# EAGLE schematic TP_DESIGN (EAGLE 5.11)
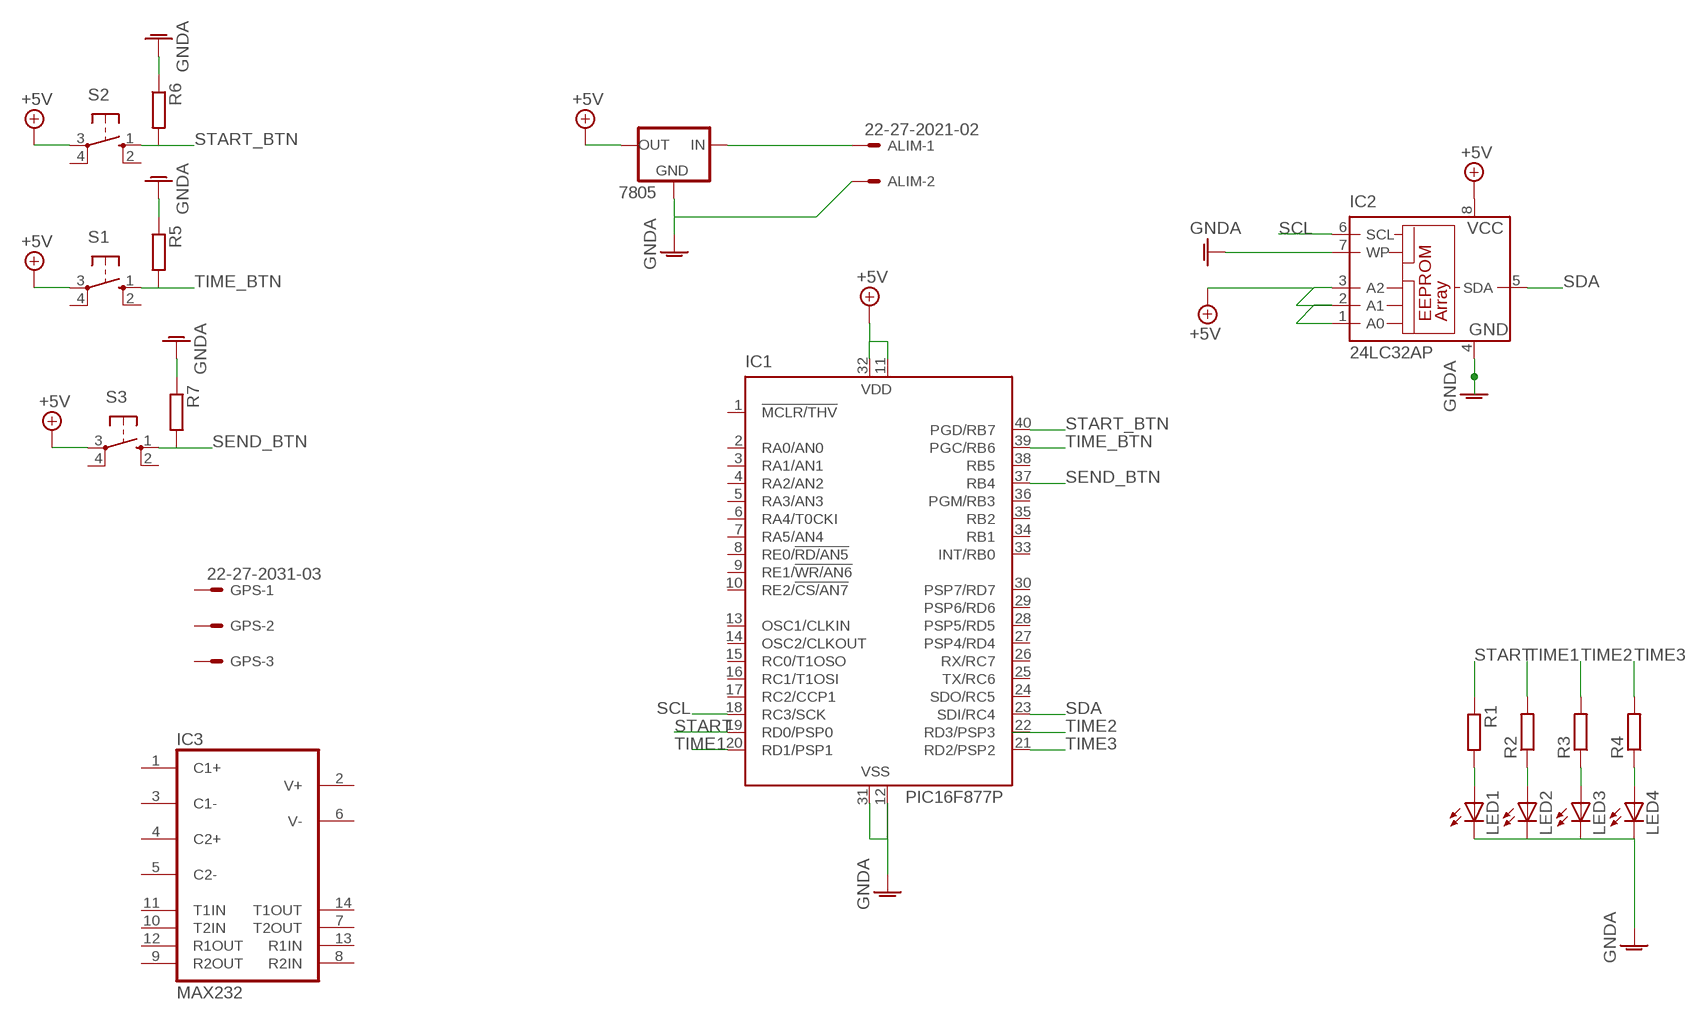
[diagram p0: schematic, sheet 1]

## Parts
7805  78XXL  [78XXL]
ALIM  22-27-2021-02  [6410-02]
GPS  22-27-2031-03  [6410-03]
IC1  PIC16F877P  [DIL40]
IC2  24LC32AP  [DIL8]
IC3  MAX232  [DIL16]
LED1  LED5MM  [LED5MM]
LED2  LED5MM  [LED5MM]
LED3  LED5MM  [LED5MM]
LED4  LED5MM  [LED5MM]
R1  R-EU_0207/10  [0207/10]
R2  R-EU_0207/10  [0207/10]
R3  R-EU_0207/10  [0207/10]
R4  R-EU_0207/10  [0207/10]
R5  R-EU_0207/10  [0207/10]
R6  R-EU_0207/10  [0207/10]
R7  R-EU_0207/10  [0207/10]
S1  10-XX  [B3F-10XX]
S2  10-XX  [B3F-10XX]
S3  10-XX  [B3F-10XX]

## Nets
+5V: 7805.OUT IC1.11(VDD) IC1.32(VDD) IC2.1(A0) IC2.2(A1) IC2.3(A2) IC2.8(VCC) S1.3(P) S2.3(P) S3.3(P)
GNDA: 7805.GND ALIM.2 IC1.12(VSS) IC1.31(VSS) IC2.4(GND) IC2.7(WP) LED1.K(C) LED2.K(C) LED3.K(C) LED4.K(C) R5.1 R6.1 R7.1
N$1: LED1.A R1.2
N$2: LED2.A R2.1
N$3: LED3.A R3.1
N$4: LED4.A R4.1
N$6: 7805.IN ALIM.1
SCL: IC1.18(RC3/SCK) IC2.6(SCL)
SDA: IC1.23(SDI/RC4) IC2.5(SDA)
SEND_BTN: IC1.37(RB4) R7.2 S3.1(S)
START: IC1.19(RD0/PSP0) R1.1
START_BTN: IC1.40(PGD/RB7) R6.2 S2.1(S)
TIME1: IC1.20(RD1/PSP1) R2.2
TIME2: R3.2
TIME3: IC1.21(RD2/PSP2) R4.2
TIME_BTN: IC1.39(PGC/RB6) R5.2 S1.1(S)
Unconnected: GPS.1 GPS.2 GPS.3 IC1.1(!MCLR/THV) IC1.2(RA0/AN0) IC1.3(RA1/AN1) IC1.4(RA2/AN2) IC1.5(RA3/AN3) IC1.6(RA4/T0CKI) IC1.7(RA5/AN4) IC1.8(RE0/!RD/AN5) IC1.9(RE1/!WR/AN6) IC1.10(RE2/!CS/AN7) IC1.13(OSC1/CLKIN) IC1.14(OSC2/CLKOUT) IC1.15(RC0/T1OSO) IC1.16(RC1/T1OSI) IC1.17(RC2/CCP1) IC1.22(RD3/PSP3) IC1.24(SDO/RC5) IC1.25(TX/RC6) IC1.26(RX/RC7) IC1.27(PSP4/RD4) IC1.28(PSP5/RD5) IC1.29(PSP6/RD6) IC1.30(PSP7/RD7) IC1.33(INT/RB0) IC1.34(RB1) IC1.35(RB2) IC1.36(PGM/RB3) IC1.38(RB5) IC3.1(C1+) IC3.2(V+) IC3.3(C1-) IC3.4(C2+) IC3.5(C2-) IC3.6(V-) IC3.7(T2OUT) IC3.8(R2IN) IC3.9(R2OUT) IC3.10(T2IN) IC3.11(T1IN) IC3.12(R1OUT) IC3.13(R1IN) IC3.14(T1OUT) S1.2(S1) S1.4(P1) S2.2(S1) S2.4(P1) S3.2(S1) S3.4(P1)

## Power pins joined to a net without a drawn wire
GNDA: IC3.15(GND)
VCC: IC3.16(VCC)

## Library data of the parts
7805 = v-reg:78XXL: VOLTAGE REGULATOR
ALIM = con-molex:22-?-02: CONNECTOR wire to board 2.54 mm (.1 inch) pitch header; OC_FARNELL: unknown; OC_NEWARK: unknown
GPS = con-molex:22-?-03: CONNECTOR wire to board 2.54 mm (.1 inch) pitch header; OC_FARNELL: unknown; OC_NEWARK: unknown
IC1 = microchip:PIC16F87*: MICROCONTROLLER; MF: MICROCHIP; MPN: PIC16F877-04/P; OC_FARNELL: 9761349; OC_NEWARK: 61K3463
IC2 = microchip:24*: Serial EEPROM I2C; MF: MICROCHIP; MPN: 24LC32A/P; OC_FARNELL: 1084246; OC_NEWARK: 75K1884
IC3 = maxim:MAX232: RS232 TRANSEIVER; MF: MAXIM; MPN: MAX232ACPE+; OC_FARNELL: 9723773; OC_NEWARK: 68K4544
LED1-LED4 = led:LED: LED OSRAM: - CHIPLED LG R971, LG N971, LY N971, LG Q971, LY Q971, LO R971, LY R971 LH N974, LH R974 LS Q976, LO Q976, LY Q976 LO Q996 - Hyper CHIPLED LW Q18S LB Q993, LB Q99A, LB R99A - SideLED LS A670, LO A670, LY A670, LG A670, LP A670 LB A673, LV A673, LT A673, LW A673 LH A674 LY A675 LS A676, LA A676, LO A676, LY A676, LW A676 LS A679, LY A679, LG A679 - Hyper Micro SIDELED® LS Y876, LA Y876, LO Y876, LY Y876 LT Y87S - SmartLED LW L88C, LW L88S LB L89C, LB L89S, LG L890 LS L89K, LO L89K, LY L89K LS L896, LA L896, LO L896, LY L896 - TOPLED LS T670, LO T670, LY T670, LG T670, LP T670 LSG T670, LSP T670, LSY T670, LOP T670, LYG T670 LG T671, LOG T671, LSG T671 LB T673, LV T673, LT T673, LW T673 LH T674 LS T676, LA T676, LO T676, LY T676, LB T676, LH T676, LSB T676, LW T676 LB T67C, LV T67C, LT T67C, LS T67K, LO T67K, LY T67K, LW E67C LS E67B, LA E67B, LO E67B, LY E67B, LB E67C, LV E67C, LT E67C LW T67C LS T679, LY T679, LG T679 LS T770, LO T770, LY T770, LG T770, LP T770 LB T773, LV T773, LT T773, LW T773 LH T774 LS E675, LA E675, LY E675, LS T675 LS T776, LA T776, LO T776, LY T776, LB T776 LHGB T686 LT T68C, LB T68C - Hyper Mini TOPLED® LB M676 - Mini TOPLED Santana® LG M470 LS M47K, LO M47K, LY M47K Source: http://www.osram.convergy.de LUXEON: - LUMILED® LXK2-PW12-R00, LXK2-PW12-S00, LXK2-PW14-U00, LXK2-PW14-V00 LXK2-PM12-R00, LXK2-PM12-S00, LXK2-PM14-U00 LXK2-PE12-Q00, LXK2-PE12-R00, LXK2-PE12-S00, LXK2-PE14-T00, LXK2-PE14-U00 LXK2-PB12-K00, LXK2-PB12-L00, LXK2-PB12-M00, LXK2-PB14-N00, LXK2-PB14-P00, LXK2-PB14-Q00 LXK2-PR12-L00, LXK2-PR12-M00, LXK2-PR14-Q00, LXK2-PR14-R00 LXK2-PD12-Q00, LXK2-PD12-R00, LXK2-PD12-S00 LXK2-PH12-R00, LXK2-PH12-S00 LXK2-PL12-P00, LXK2-PL12-Q00, LXK2-PL12-R00 Source: www.luxeon.com KINGBRIGHT: KA-3528ASYC Source: www.kingbright.com
R1-R7 = rcl:R-EU_: RESISTOR, European symbol
S1-S3 = switch-omron:10-XX: OMRON SWITCH; MPN: B3F-1000; OC_FARNELL: 176432; OC_NEWARK: 36M3542